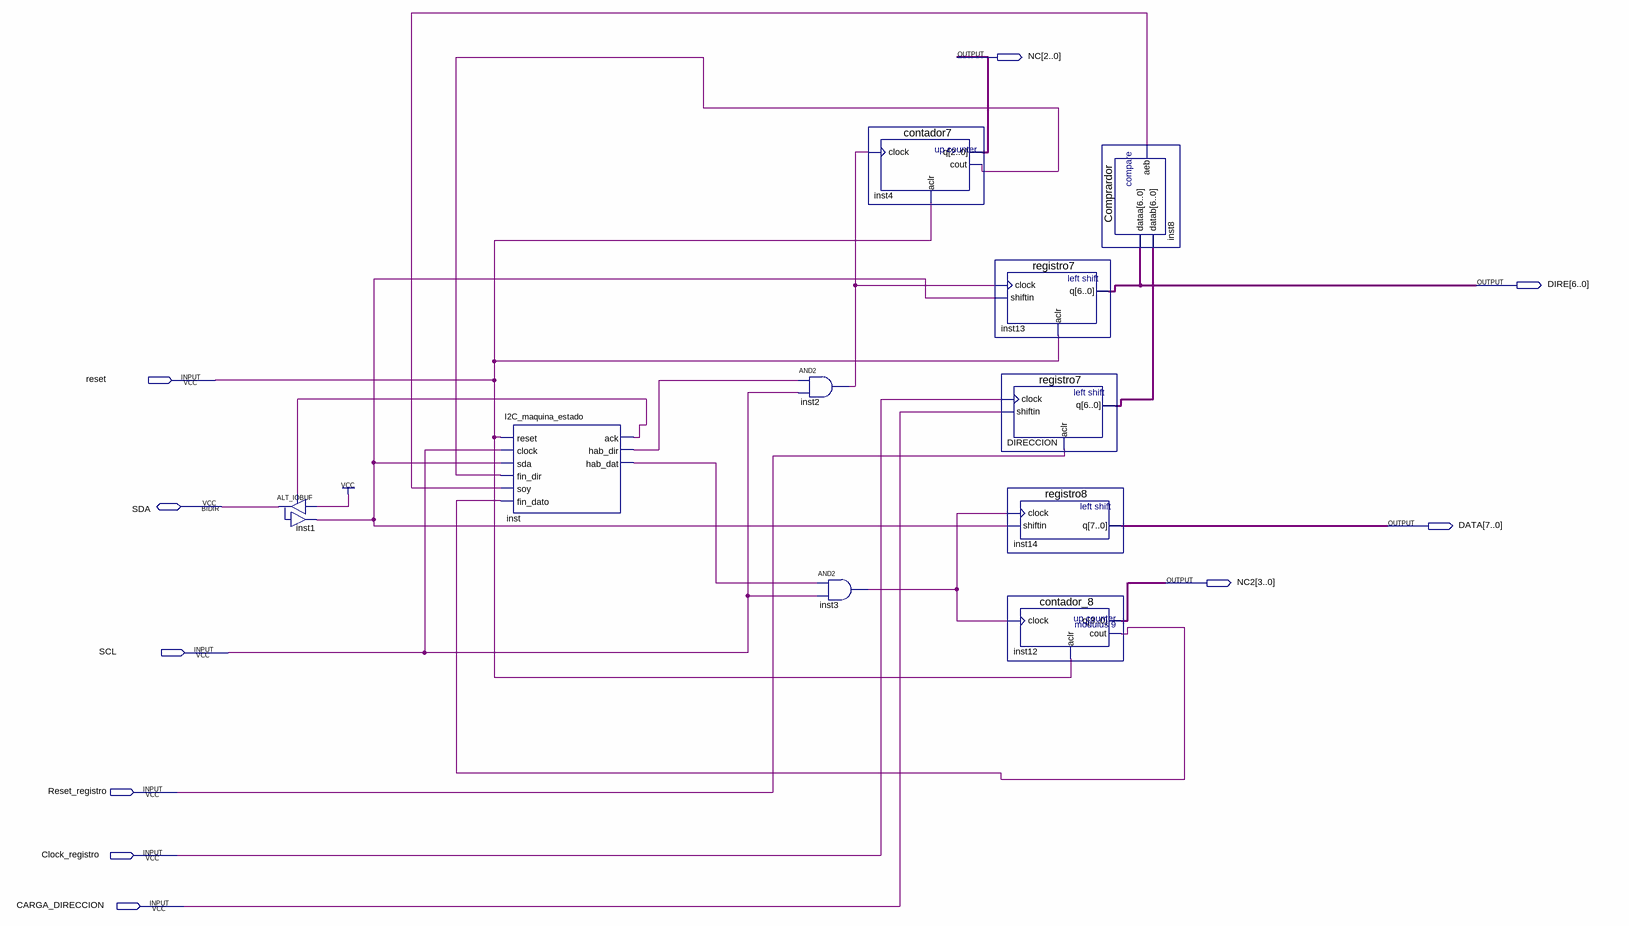
[diagram p0: schematic sheet]
// Quartus schematic bloque_maquina_estado.bdf as structural Verilog: 10 symbols, 10 pins
module bloque_maquina_estado (
  input  reset,
  input  SCL,
  input  Reset_registro,
  input  Clock_registro,
  input  CARGA_DIRECCION,
  inout  SDA,
  output [2:0] NC,
  output [6:0] DIRE,
  output [7:0] DATA,
  output [3:0] NC2
);

  wire inst1_o, inst2_out, inst3_out, inst4_cout, inst8_aeb, inst12_cout, inst_ack, inst_hab_dat,
       inst_hab_dir;
  wire [6:0] DIRECCION_q;

  ALT_IOBUF inst1 (.i(1'b1), .oe(inst_ack), .o(inst1_o), .io(SDA));
  I2C_maquina_estado inst (
    .reset(reset), .clock(SCL), .sda(inst1_o), .fin_dir(inst4_cout), .soy(inst8_aeb), .fin_dato(inst12_cout),
    .ack(inst_ack), .hab_dir(inst_hab_dir), .hab_dat(inst_hab_dat));
  and inst2 (inst2_out, inst_hab_dir, SCL);
  and inst3 (inst3_out, inst_hab_dat, SCL);
  contador7 inst4 (.clock(inst2_out), .aclr(reset), .cout(inst4_cout), .q(NC));
  registro7 inst13 (.clock(inst2_out), .shiftin(inst1_o), .aclr(reset), .q(DIRE));
  registro7 DIRECCION (.clock(Clock_registro), .shiftin(CARGA_DIRECCION), .aclr(Reset_registro), .q(DIRECCION_q));
  registro8 inst14 (.clock(inst3_out), .shiftin(inst1_o), .q(DATA));
  contador_8 inst12 (.clock(inst3_out), .aclr(reset), .cout(inst12_cout), .q(NC2));
  Comprardor inst8 (.dataa(DIRE), .datab(DIRECCION_q), .aeb(inst8_aeb));
endmodule
